# Altium schematic sheet Pedal_WS2812.SchDoc
size A4; SheetNumber: 1; SheetTotal: 1
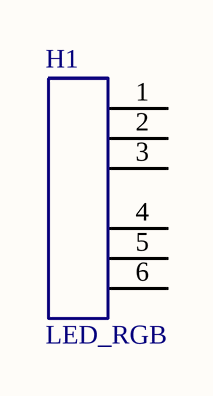
[diagram p0: Pedal_WS2812.SchDoc]

## Parts
H1  LED_RGB  [header-6_male]

## Nets

Not connected (* = marked no-connect by the designer): H1 1 2 3 4 5 6

## Library data of the parts
H1 = arduino_header_6: System: Connector